# EAGLE schematic ps2card (EAGLE 9.6.2)
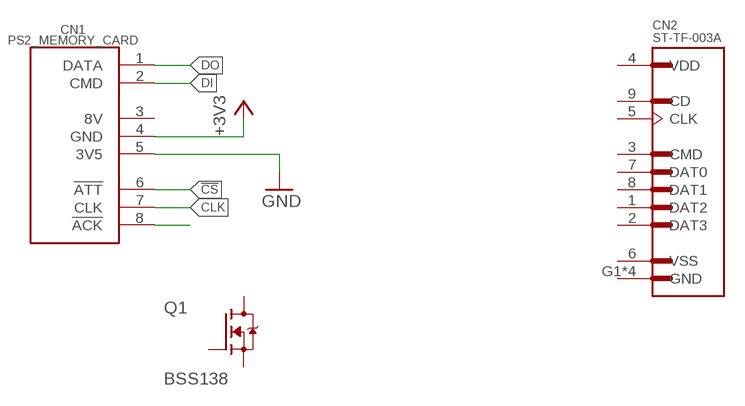
[diagram p0: schematic, sheet 1]

## Parts
CN1  PS2_MEMORY_CARD  PLAYSTATION_MEMORY_CARD  [PS2_MEMORY_CARD]
CN2  ST-TF-003A  [SUNTECH_ST-TF-003A]
Q1  BSS138  [SOT95P240X111-3N]

## Nets
!CS: CN1.6(!ATT)
+3V3: CN1.4(GND)
CLK: CN1.7(CLK)
DI: CN1.2(CMD)
DO: CN1.1(DATA)
GND: CN1.5(3V5)
N$7: CN1.8(!ACK)
Unconnected: CN1.3(8V) CN2.1(DAT2) CN2.2(DAT3) CN2.3(CMD) CN2.5(CLK) CN2.6(VSS) CN2.7(DAT0) CN2.8(DAT1) CN2.9(CD) CN2.G1(GND) CN2.G2(GND) CN2.G3(GND) CN2.G4(GND) Q1.1(G) Q1.2(S) Q1.3(D)

## Power pins joined to a net without a drawn wire
VDD: CN2.4(VDD)

## Library data of the parts
CN1 = PlayStation Memory Card:PLAYSTATION_MEMORY_CARD
CN2 = ST-TF-003A:ST-TF-003A: Micro SD Card Socket Check availability <https://pricing.snapeda.com/parts/ST-TF-003A/Suntech/view-part?ref=eda>; AVAILABILITY: Not in stock; DESCRIPTION: Micro SD Card Socket; MF: Suntech; MP: ST-TF-003A; PACKAGE: None; PRICE: None
Q1 = BSS138:BSS138: N-Channel 50V 220mA (Ta) 360mW (Ta) Surface Mount SOT-23-3 Check availability <https://pricing.snapeda.com/parts/BSS138/ON%20Semiconductor/view-part?ref=eda>; AVAILABILITY: In Stock; DESCRIPTION: N-Channel 50 V 200mA (Ta) 225mW (Ta) Surface Mount SOT-23-3 (TO-236); MF: ON Semiconductor; MP: BSS138; PACKAGE: SOT-23 ON; PRICE: None